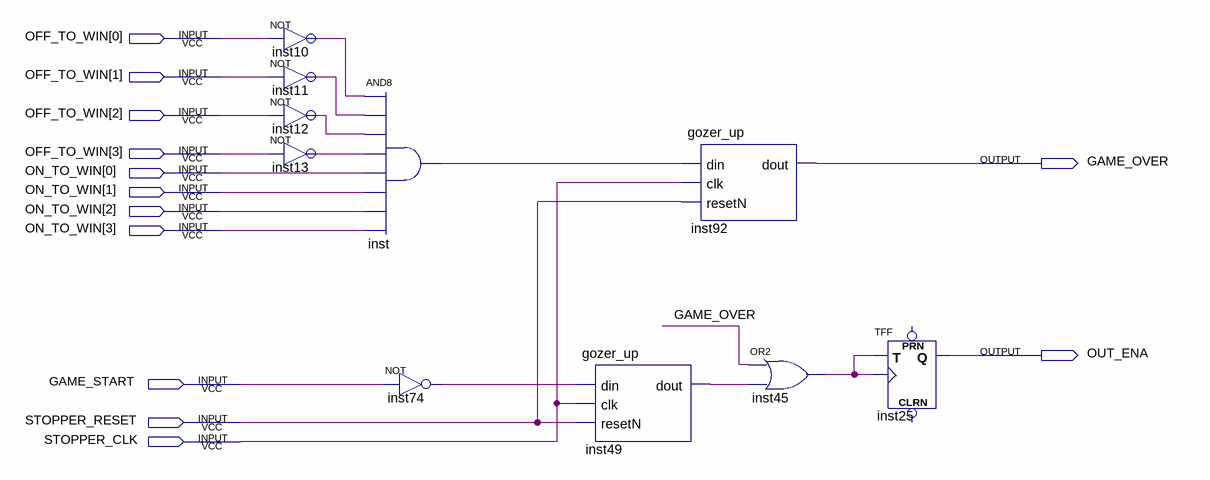
[diagram p0: schematic sheet]
// Quartus schematic StopperControl.bdf as structural Verilog: 10 symbols, 13 pins
module StopperControl (
  input  [3:0] OFF_TO_WIN,
  input  [3:0] ON_TO_WIN,
  input  GAME_START,
  input  STOPPER_RESET,
  input  STOPPER_CLK,
  output GAME_OVER,
  output OUT_ENA
);

  wire inst10_out, inst11_out, inst12_out, inst13_out, inst45_out, inst49_dout, inst74_out, inst_out;

  not inst10 (inst10_out, OFF_TO_WIN[0]);
  not inst11 (inst11_out, OFF_TO_WIN[1]);
  not inst12 (inst12_out, OFF_TO_WIN[2]);
  not inst13 (inst13_out, OFF_TO_WIN[3]);
  and inst (inst_out, inst10_out, inst11_out, inst12_out, inst13_out, ON_TO_WIN[0], ON_TO_WIN[1], ON_TO_WIN[2], ON_TO_WIN[3]);
  not inst74 (inst74_out, GAME_START);
  gozer_up inst49 (.din(inst74_out), .clk(STOPPER_CLK), .resetN(STOPPER_RESET), .dout(inst49_dout));
  gozer_up inst92 (.din(inst_out), .clk(STOPPER_CLK), .resetN(STOPPER_RESET), .dout(GAME_OVER));
  or inst45 (inst45_out, GAME_OVER, inst49_dout);
  TFF inst25 (.T(inst45_out), .CLK(inst45_out), .Q(OUT_ENA));  // open: PRN, CLRN
endmodule
